# Altium schematic sheet [10] - RFID.SchDoc
size A4
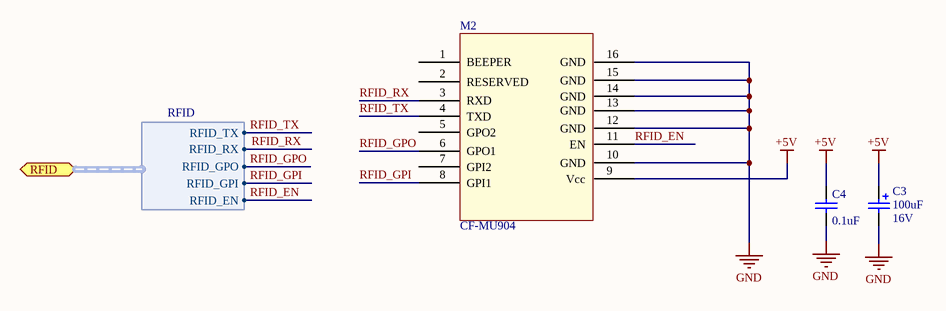
[diagram p0: [10] - RFID.SchDoc]

## Parts
C3  Capacitance: 100uF  Voltage - Rated: 16V  [Tantalum 3216 A]  (hidden comment: Capacitor Polarized)
C4  value 0.1uF  [Cap 0603]  (hidden comment: Capacitor)
M2  CF-MU904

## Ports
RFID (harness RFID)

## Harnesses
RFID: RFID_TX, RFID_RX, RFID_GPO, RFID_GPI, RFID_EN

## Nets
+5V: C3.1 C4.2 M2.9(Vcc)
GND: C3.2 C4.1 M2.10(GND) M2.12(GND) M2.13(GND) M2.14(GND) M2.15(GND) M2.16(GND)
RFID_EN: M2.11(EN) ; port RFID.RFID_EN
RFID_GPI: M2.8(GPI1) ; port RFID.RFID_GPI
RFID_GPO: M2.6(GPO1) ; port RFID.RFID_GPO
RFID_RX: M2.3(RXD) ; port RFID.RFID_RX
RFID_TX: M2.4(TXD) ; port RFID.RFID_TX

Not connected (* = marked no-connect by the designer): M2 1(BEEPER) 2(RESERVED) 5(GPO2) 7(GPI2)

## Notes on the sheet
- Title
- Size:
- Date:
- A4
- Number:
- Time:
- Revision:
- Sheet
- of
- File:

## Library data of the parts
C3 = 2: Tantalum Capacitor; Manufacturer: Kemet; Manufacturer Part Number: T491A106K016AT; Manufacturer Size Code: A; Tolerance: ±10%; ESR (Equivalent Series Resistance): 7 Ohm; Type: Molded; Lifetime @ Temp.: 2000 Hrs @ 85°C; Supplier 1: Digi-Key; Supplier Part Number 1: 399-8269-1-ND; RoHS: RoHS Compliant; Category: Capacitors; Stock 1: 46669; Pricing 1: 1=0.41, 10=0.362, 50=0.2198, 100=0.181, 250=0.14476, 500=0.13184, 1000=0.11891 (USD); Packaging: Cut Tape (CT); Operating Temperature: -55°C ~ 125°C; Mounting Type: Surface Mount; Package / Case: 1206 (3216 Metric); Size / Dimension: 0.126" L x 0.063" W (3.20mm x 1.60mm); Height - Seated (Max): 0.071" (1.80mm); Lead Spacing: -; Features: General Purpose; ComponentLink1URL: http://www.kemet.com/Lists/ProductCatalog/Attachments/254/KEM_T2005_T491.pdf; ComponentLink1Description: http://www.kemet.com/Lists/ProductCatalog/Attachments/254/KEM_T2005_T491.pdf
C4 = 1: Capacitor 0603 CER; Manufacturer: Kemet; Manufacturer Part Number: C0603C473K5RACTU; Capacitance: 0.047µF; Tolerance: ±10%; Voltage - Rated: 50V; Temperature Coefficient: X7R; Supplier 1: Digi-Key; Supplier Part Number 1: 399-7933-1-ND; RoHS: RoHS Compliant; Category: Capacitors; Stock 1: 66523; Pricing 1: 1=0.1, 10=0.059, 25=0.0416, 50=0.0318, 100=0.0269, 250=0.02204, 1000=0.0144 (USD); Packaging: Cut Tape (CT); Mounting Type: Surface Mount, MLCC; Operating Temperature: -55°C ~ 125°C; Applications: General Purpose; Ratings: -; Package / Case: 0603 (1608 Metric); Size / Dimension: 0.063" L x 0.031" W (1.60mm x 0.80mm); Height - Seated (Max): -; Thickness (Max): 0.034" (0.87mm); Lead Spacing: -; Features: -; Lead Style: -; ComponentLink1URL: http://www.kemet.com/docfinder?Partnumber=C0603C473K5RACTU; ComponentLink1Description: http://www.kemet.com/docfinder?Partnumber=C0603C473K5RACTU